# Altium schematic sheet Base Station Schematic.SchDoc: Base Station Schematic
size A4; Organization: Altium Limited; Address1: L3, 12a Rodborough Rd; Address2: Frenchs Forest; Address3: NSW; Address4: Australia 2086; DocumentNumber: 1; Revision: V1.0; SheetNumber: 1; SheetTotal: 1
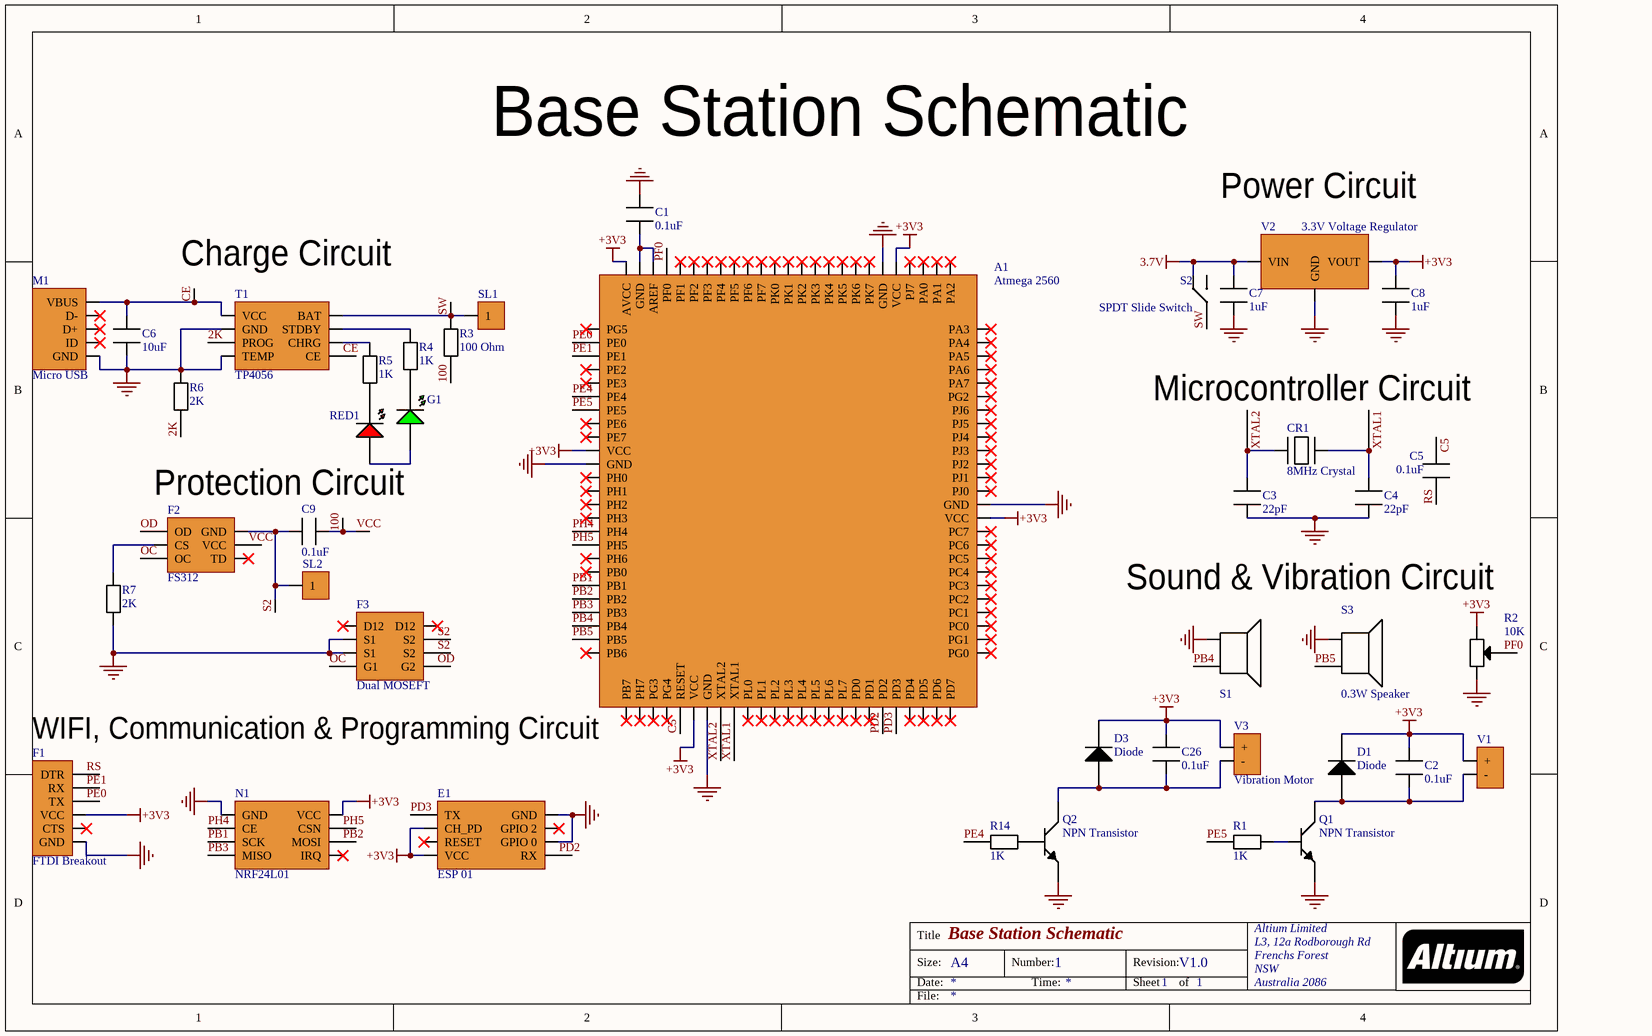
[diagram p0: Base Station Schematic.SchDoc]

## Parts
A1  Atmega 2560  [Atmega 2560]
C1  0.1uF  [0.1uF Capacitor]
C2  0.1uF  [0.1uF Capacitor]
C3  22pF  [22pF Capacitor]
C4  22pF  [22pF Capacitor]
C5  0.1uF  [0.1uF Capacitor]
C6  10uF  [10uF Capactior]
C7  1uF  [1uF Capacitor]
C8  1uF  [1uF Capacitor]
C9  0.1uF  [0.1uF Capacitor]
C26  0.1uF  [0.1uF Capacitor]
CR1  8MHz Crystal  [8MHz Crystal]
D1  Diode  [Diode]
D3  Diode  [Diode]
E1  ESP 01  [ESP 01]
F1  FTDI Breakout  [FTDI]
F2  FS312  [FS312]
F3  Dual MOSEFT  [FS8205]
G1  Green LED  [Green LED]  (value not drawn)
M1  Micro USB  [Micro USB]
N1  NRF24L01  [NRF24L01]
Q1  NPN Transistor  [NPN Transistor]
Q2  NPN Transistor  [NPN Transistor]
R1  1K  [1K Resistor]
R2  10K  [10K Potentiometer]
R3  100 Ohm  [100 Ohm Resistor]
R4  1K  [1K Resistor]
R5  1K  [1K Resistor]
R6  2K  [2K Resistor]
R7  2K  [2K Resistor]
R14  1K  [1K Resistor]
RED1  Red LED  [Red LED]  (value not drawn)
S1  0.3W Speaker  [0.3W Speaker]  (value not drawn)
S2  SPDT Slide Switch  [Slide Switch]
S3  0.3W Speaker  [0.3W Speaker]
SL1  Solder Pads  [Solder Pads]  (value not drawn)
SL2  Solder Pads  [Solder Pads]  (value not drawn)
T1  TP4056  [TP4056]
V1  Vibration Motor  [Vibration Motor]  (value not drawn)
V2  3.3V Voltage Regulator  [Voltage Regulator]
V3  Vibration Motor  [Vibration Motor]

## Nets
3.7V: C7.2 S2.3 V2.3(VIN)
+3V3: A1.10(VCC) A1.31(VCC) A1.61(VCC) A1.80(VCC) A1.100(AVCC) C2.1 C8.2 C26.2 D1.1 D3.1 E1.2(CH_PD) E1.4(VCC) F1.4(VCC) N1.5(VCC) R2.1 V1.2(+) V2.2(VOUT) V3.2(+)
GND: A1.11(GND) A1.32(GND) A1.62(GND) A1.81(GND) C1.1 C3.1 C4.1 C6.1 C7.1 C8.1 E1.5(GND) E1.7(GPIO_0) F1.6(GND) F3.2(S1) F3.3(S1) M1.5(GND) N1.1(GND) Q1.2 Q2.2 R2.3 R6.2 R7.1 S1.1 S3.1 T1.1(TEMP) T1.3(GND) V2.1(GND)
2K: R6.1 T1.2(PROG)
100: C9.1 F2.5(VCC) R3.2  [also labelled VCC]
C5: A1.30(RESET) C5.2
CE: C6.2 M1.1(VBUS) T1.4(VCC) T1.8(CE)
OC: F2.3(OC) F3.4(G1)
OD: F2.1(OD) F3.5(G2)
PB1: A1.20(PB1) N1.3(SCK)
PB2: A1.21(PB2) N1.7(MOSI)
PB3: A1.22(PB3) N1.4(MISO)
PB4: A1.23(PB4) S1.2
PB5: A1.24(PB5) S3.2
PD2: A1.45(PD2) E1.8(RX)
PD3: A1.46(PD3) E1.1(TX)
PE0: A1.2(PE0) F1.3(TX)
PE1: A1.3(PE1) F1.2(RX)
PE4: A1.6(PE4) R14.1
PE5: A1.7(PE5) R1.1
PF0: A1.97(PF0) R2.2
PH4: A1.16(PH4) N1.2(CE)
PH5: A1.17(PH5) N1.6(CSN)
RS: C5.1 F1.1(DTR)
S2: C9.2 F2.6(GND) F3.6(S2) F3.7(S2) SL2.1
SW: R3.1 S2.2 SL1.1 T1.5(BAT)
XTAL1: A1.34(XTAL1) C4.2 CR1.2
XTAL2: A1.33(XTAL2) C3.2 CR1.1
NetA1_98: A1.98(AREF) A1.99(GND) C1.2
NetC2_2: C2.2 D1.2 Q1.3 V1.1(-)
NetC26_1: C26.1 D3.2 Q2.3 V3.1(-)
NetF2_2: F2.2(CS) R7.2
NetG1_1: G1.1 R4.1
NetG1_2: G1.2 RED1.2
NetQ1_1: Q1.1 R1.2
NetQ2_1: Q2.1 R14.2
NetR4_2: R4.2 T1.6(STDBY)
NetR5_1: R5.1 RED1.1
NetR5_2: R5.2 T1.7(CHRG)

Not connected (* = marked no-connect by the designer): A1 1(PG5)* 4(PE2)* 5(PE3)* 8(PE6)* 9(PE7)* 12(PH0)* 13(PH1)* 14(PH2)* 15(PH3)* 18(PH6)* 19(PB0)* 25(PB6)* 26(PB7)* 27(PH7)* 28(PG3)* 29(PG4)* 35(PL0)* 36(PL1)* 37(PL2)* 38(PL3)* 39(PL4)* 40(PL5)* 41(PL6)* 42(PL7)* 43(PD0)* 44(PD1)* 47(PD4)* 48(PD5)* 49(PD6)* 50(PD7)* 51(PG0)* 52(PG1)* 53(PC0)* 54(PC1)* 55(PC2)* 56(PC3)* 57(PC4)* 58(PC5)* 59(PC6)* 60(PC7)* 63(PJ0)* 64(PJ1)* 65(PJ2)* 66(PJ3)* 67(PJ4)* 68(PJ5)* 69(PJ6)* 70(PG2)* 71(PA7)* 72(PA6)* 73(PA5)* 74(PA4)* 75(PA3)* 76(PA2)* 77(PA1)* 78(PA0)* 79(PJ7)* 82(PK7)* 83(PK6)* 84(PK5)* 85(PK4)* 86(PK3)* 87(PK2)* 88(PK1)* 89(PK0)* 90(PF7)* 91(PF6)* 92(PF5)* 93(PF4)* 94(PF3)* 95(PF2)* 96(PF1)*; E1 3(RESET)* 6(GPIO_2)*; F1 5(CTS)*; F2 4(TD)*; F3 1(D12)* 8(D12)*; M1 2(D-)* 3(D+)* 4(ID)*; N1 8(IRQ)*; S2 1

## Notes on the sheet
- Power Circuit
- Charge Circuit
- Microcontroller Circuit
- (near RED1) Protection Circuit
- Sound & Vibration Circuit
- (near A1) WIFI, Communication & Programming Circuit
- Title
- Size:
- Date:
- A4
- Number:
- Time:
- Revision:
- Sheet
- of
- File:

## Library data of the parts
A1 = ATMEGA2560V-8AU: MICROCHIP - ATMEGA2560V-8AU - 8 Bit MCU, AVR ATmega Family ATmega256X Series Microcontrollers, 8 MHz, 256 KB, 8 KB, 100 Pins; Manufacturer: Microchip / Atmel; Data Bus Width: 8b; Min Supply Voltage: 1.8V; Max Supply Voltage: 5.5V; Interface: I2C,SPI,UART,USART,EBI/EMI,2-Wire; Number of Inputs: 86; Number of PWM Channels: 16; RAM Size: 8KB; Number of Timers/Counters: 6; Frequency: 8MHz; Density: 256KB; Number of UART Channels: 4; Oscillator Type: Internal; Memory Type: FLASH; Number of Bits: 8; Number of SPI Channels: 1; Watchdog Timer: Yes; Access Time: 8us; Peripherals: Brown-out Detect/Reset,POR,PWM,WDT; Supplier 1: Digi-Key; Manufacturer Part Number: ATMEGA2560V-8AU; RoHS: Yes; Category: Microcontrollers; Stock 1: 509; Pricing 1: 1=11.85000, 25=10.86000, 100=9.84000 (USD); Mount: Surface Mount; Case/Package: A; Number of Pins: 100; Contact Plating: Tin,Matte; Min Operating Temperature: -40°C; Max Operating Temperature: 85°C; Package Quantity: 90; Core Architecture: AVR; Packaging: Tray; Number of Outputs: 86; Number of I/Os: 86; Number of ADC Channels: 16; Number of Programmable I/O: 86; Max Frequency: 8MHz; Number of I2C Channels: 1; Address Bus Width: 8b; Memory Size: 256KB; Length: 14.1mm; Width: 14.1mm; Height: 1.05mm; Radiation Hardening: No; REACH SVHC: No SVHC; Lead Free: Lead Free; ComponentLink1URL: https://datasheet.ciiva.com/1497/2549s-1497984.pdf?src-supplier=Digi-Key; ComponentLink1Description: https://datasheet.ciiva.com/1497/2549s-1497984.pdf?src-supplier=Digi-Key; ComponentLink2URL: https://datasheet.ciiva.com/22651/82608-22651121.pdf?src-supplier=Farnell; ComponentLink2Description: https://datasheet.ciiva.com/22651/82608-22651121.pdf?src-supplier=Farnell; ComponentLink3URL: https://datasheet.ciiva.com/15122/getdatasheetpartid-144096-15122668.pdf?src-supplier=Verical; ComponentLink3Description: https://datasheet.ciiva.com/15122/getdatasheetpartid-144096-15122668.pdf?src-supplier=Verical; ComponentLink4URL: https://datasheet.ciiva.com/26815/atmega2560v-8au-26815443.pdf?src-supplier=IIIC; ComponentLink4Description: https://datasheet.ciiva.com/26815/atmega2560v-8au-26815443.pdf?src-supplier=IIIC; ComponentLink5URL: https://datasheet.ciiva.com/29329/154791-da-01-en-atmega2560v-8au-tqfp-100-29329598.pdf?src-supplier=Conrad; ComponentLink5Description: https://datasheet.ciiva.com/29329/154791-da-01-en-atmega2560v-8au-tqfp-100-29329598.pdf?src-supplier=Conrad; ComponentLink6URL: https://datasheet.ciiva.com/1157/82608-1157522.pdf?src-supplier=Element14; ComponentLink6Description: https://datasheet.ciiva.com/1157/82608-1157522.pdf?src-supplier=Element14; ComponentLink7URL: https://datasheet.ciiva.com/16935/70123980-16935865.pdf?src-supplier=Allied+Electronics; ComponentLink7Description: https://datasheet.ciiva.com/16935/70123980-16935865.pdf?src-supplier=Allied+Electronics; Supplier Part Number 1: ATMEGA2560V-8AU-ND
C1 C2 C5 C9 C26 = 06033C104KAT4A: CAP CER 0.1UF 25V X7R 0603; Manufacturer: Kyocera AVX; Capacitance: 100nF; Tolerance: 10%; Supplier 1: Digi-Key; Manufacturer Part Number: 06033C104KAT4A; RoHS: Yes; Category: Ceramic Capacitors; Stock 1: 6112957; Pricing 1: 1=0.10000, 10=0.04200, 50=0.02320, 100=0.01890, 500=0.01348, 1000=0.01059, 2500=0.00962, 5000=0.00886 (USD); Mount: Surface Mount; Case/Package: 0603; Number of Pins: 2; Case Code (Metric): 1608; Case Code (Imperial): 0603; Min Operating Temperature: -55°C; Max Operating Temperature: 125°C; Packaging: Tape and Reel; Voltage Rating (DC): 25V; Dielectric: X7R; Package Quantity: 1; Voltage Rating: 25V; Termination: SMD/SMT; Length: 1.6mm; Width: 0.032inch; Height: 0.9mm; Thickness: 0.035inch; Depth: 0.81mm; REACH SVHC: No SVHC; Lead Free: Lead Free; ComponentLink1URL: https://datasheet.ciiva.com/22619/1679506-22619862.pdf?src-supplier=Element14; ComponentLink1Description: https://datasheet.ciiva.com/22619/1679506-22619862.pdf?src-supplier=Element14; ComponentLink2URL: https://datasheet.ciiva.com/28613/1679506-28613035.pdf?src-supplier=Element14; ComponentLink2Description: https://datasheet.ciiva.com/28613/1679506-28613035.pdf?src-supplier=Element14; ComponentLink3URL: https://datasheet.ciiva.com/6277/cx7r-6277758.pdf?src-supplier=Digi-Key; ComponentLink3Description: https://datasheet.ciiva.com/6277/cx7r-6277758.pdf?src-supplier=Digi-Key; ComponentLink4URL: https://datasheet.ciiva.com/6277/cx7r-6277759.pdf?src-supplier=Digi-Key; ComponentLink4Description: https://datasheet.ciiva.com/6277/cx7r-6277759.pdf?src-supplier=Digi-Key; Supplier Part Number 1: 478-7018-1-ND
C3 C4 = 06035A220JAT2A: Cap Ceramic 22pF 50V C0G 5% SMD 0603 125C Paper T/R; Manufacturer: Kyocera AVX; Insulation Resistance: 100GR; Temperature Coefficient: 30ppm/°C; Supplier 1: Digi-Key; Manufacturer Part Number: 06035A220JAT2A; RoHS: Yes; Category: Ceramic Capacitors; Stock 1: 678111; Pricing 1: 1=0.10000, 10=0.05600, 50=0.03040, 100=0.02480, 500=0.01772, 1000=0.01392 (USD); Mount: Surface Mount,PCB; Case/Package: 0603; Number of Pins: 2; Case Code (Imperial): 0603; Case Code (Metric): 1608; Contact Plating: Tin,Matte; Dielectric Material: Ceramic; Min Operating Temperature: -55°C; Max Operating Temperature: 125°C; Tolerance: 5%; Capacitance: 22pF; Voltage Rating (DC): 50V; Packaging: Tape and Reel; Dielectric: C0G; Voltage: 50V; Voltage Rating: 50V; Package Quantity: 1; Termination: SMD/SMT; Length: 1.6mm; Width: 0.81mm; Height: 0.63mm; Thickness: 0.035inch; Depth: 0.81mm; Radiation Hardening: No; REACH SVHC: No SVHC; Lead Free: Lead Free; ComponentLink1URL: https://datasheet.ciiva.com/11788/0900766b802d4697-11788031.pdf?src-supplier=RSComponents; ComponentLink1Description: https://datasheet.ciiva.com/11788/0900766b802d4697-11788031.pdf?src-supplier=RSComponents; ComponentLink2URL: https://datasheet.ciiva.com/16351/ccog-16351125.pdf?src-supplier=Future+Electronics; ComponentLink2Description: https://datasheet.ciiva.com/16351/ccog-16351125.pdf?src-supplier=Future+Electronics; ComponentLink3URL: https://datasheet.ciiva.com/1124/759117-1124728.pdf?src-supplier=Element14; ComponentLink3Description: https://datasheet.ciiva.com/1124/759117-1124728.pdf?src-supplier=Element14; ComponentLink4URL: https://datasheet.ciiva.com/7855/759117-7855064.pdf?src-supplier=Element14; ComponentLink4Description: https://datasheet.ciiva.com/7855/759117-7855064.pdf?src-supplier=Element14; ComponentLink5URL: https://datasheet.ciiva.com/150/ccog-150366.pdf?src-supplier=Digi-Key; ComponentLink5Description: https://datasheet.ciiva.com/150/ccog-150366.pdf?src-supplier=Digi-Key; ComponentLink6URL: https://datasheet.ciiva.com/150/ccog-150367.pdf?src-supplier=Digi-Key; ComponentLink6Description: https://datasheet.ciiva.com/150/ccog-150367.pdf?src-supplier=Digi-Key; Supplier Part Number 1: 478-1167-1-ND
C6 = 06036D106MAT2A: AVX - 06036D106MAT2A - SMD Multilayer Ceramic Capacitor, 10 µF, 6.3 V, 0603 [1608 Metric], ± 20%, X5R, AVX 0603 MLCC; Manufacturer: Kyocera AVX; Voltage Rating: 6.3V; Supplier 1: Digi-Key; Manufacturer Part Number: 06036D106MAT2A; RoHS: Yes; Category: Ceramic Capacitors; Stock 1: 2195219; Pricing 1: 1=0.24000, 10=0.16500, 50=0.09900, 100=0.08360, 500=0.05720, 1000=0.05060 (USD); Mount: Surface Mount,PCB; Case/Package: 0603; Number of Pins: 2; Case Code (Metric): 1608; Case Code (Imperial): 0603; Contact Plating: Tin,Matte; Dielectric Material: Ceramic; Min Operating Temperature: -55°C; Max Operating Temperature: 85°C; Capacitance: 10uF; Tolerance: 20%; Packaging: Tape and Reel; Package Quantity: 1; Voltage Rating (DC): 6.3V; Dielectric: X5R; Termination: SMD/SMT; Voltage: 6.3V; Length: 1.6mm; Width: 0.032inch; Height: 0.9mm; Thickness: 0.035inch; Depth: 0.81mm; Radiation Hardening: No; REACH SVHC: No SVHC; Lead Free: Lead Free; ComponentLink1URL: https://datasheet.ciiva.com/153/cx5r-153301.pdf?src-supplier=Digi-Key; ComponentLink1Description: https://datasheet.ciiva.com/153/cx5r-153301.pdf?src-supplier=Digi-Key; ComponentLink2URL: https://datasheet.ciiva.com/1458/1796776-1458117.pdf?src-supplier=Element14; ComponentLink2Description: https://datasheet.ciiva.com/1458/1796776-1458117.pdf?src-supplier=Element14; ComponentLink3URL: https://datasheet.ciiva.com/153/cx5r-153302.pdf?src-supplier=Digi-Key; ComponentLink3Description: https://datasheet.ciiva.com/153/cx5r-153302.pdf?src-supplier=Digi-Key; ComponentLink4URL: https://datasheet.ciiva.com/153/cx5r-153303.pdf?src-supplier=Digi-Key; ComponentLink4Description: https://datasheet.ciiva.com/153/cx5r-153303.pdf?src-supplier=Digi-Key; ComponentLink5URL: https://datasheet.ciiva.com/5422/cx5r-33896-5422935.pdf?src-supplier=Mouser; ComponentLink5Description: https://datasheet.ciiva.com/5422/cx5r-33896-5422935.pdf?src-supplier=Mouser; ComponentLink6URL: https://datasheet.ciiva.com/16538/cx5r-16538025.pdf?src-supplier=Avnet+Asia; ComponentLink6Description: https://datasheet.ciiva.com/16538/cx5r-16538025.pdf?src-supplier=Avnet+Asia; ComponentLink7URL: https://datasheet.ciiva.com/2987/cx5r-2987866.pdf?src-supplier=Avnet; ComponentLink7Description: https://datasheet.ciiva.com/2987/cx5r-2987866.pdf?src-supplier=Avnet; ComponentLink8URL: https://datasheet.ciiva.com/14591/70001028-14591754.pdf?src-supplier=Allied+Electronics; ComponentLink8Description: https://datasheet.ciiva.com/14591/70001028-14591754.pdf?src-supplier=Allied+Electronics; ComponentLink9URL: https://datasheet.ciiva.com/2987/cx5r-2987867.pdf?src-supplier=Avnet; ComponentLink9Description: https://datasheet.ciiva.com/2987/cx5r-2987867.pdf?src-supplier=Avnet; ComponentLink10URL: https://datasheet.ciiva.com/16201/cx5r-16201627.pdf?src-supplier=Future+Electronics; ComponentLink10Description: https://datasheet.ciiva.com/16201/cx5r-16201627.pdf?src-supplier=Future+Electronics; Supplier Part Number 1: 478-5318-1-ND
C7 C8 = 0603ZD105KAT2A: Cap Ceramic 1uF 10V X5R 10% Pad SMD 0603 85C T/R; Manufacturer: Kyocera AVX; Dissipation Factor: 5%; Insulation Resistance: 100GR; Supplier 1: Digi-Key; Manufacturer Part Number: 0603ZD105KAT2A; RoHS: Yes; Category: Ceramic Capacitors; Stock 1: 367092; Pricing 1: 1=0.19000, 10=0.13400, 50=0.07620, 100=0.06320, 500=0.04428, 1000=0.03666 (USD); Mount: Surface Mount,PCB; Case/Package: 0603; Number of Pins: 2; Case Code (Imperial): 0603; Case Code (Metric): 1608; Contact Plating: Tin,Matte; Min Operating Temperature: -55°C; Max Operating Temperature: 85°C; Capacitance: 1uF; Package Quantity: 4000; Voltage Rating: 10V; Voltage Rating (DC): 10V; Tolerance: 10%; Packaging: Tape and Reel; Dielectric: X5R; Termination: SMD/SMT; Voltage: 10V; Length: 1.6mm; Width: 0.81mm; Height: 0.9mm; Thickness: 0.035inch; Depth: 0.81mm; Radiation Hardening: No; REACH SVHC: No SVHC; Lead Free: Lead Free; ComponentLink1URL: https://datasheet.ciiva.com/11787/0900766b80a45521-11787469.pdf?src-supplier=RSComponents; ComponentLink1Description: https://datasheet.ciiva.com/11787/0900766b80a45521-11787469.pdf?src-supplier=RSComponents; ComponentLink2URL: https://datasheet.ciiva.com/2987/cx5r-2987907.pdf?src-supplier=Avnet; ComponentLink2Description: https://datasheet.ciiva.com/2987/cx5r-2987907.pdf?src-supplier=Avnet; ComponentLink3URL: https://datasheet.ciiva.com/150/cx5r-150308.pdf?src-supplier=Digi-Key; ComponentLink3Description: https://datasheet.ciiva.com/150/cx5r-150308.pdf?src-supplier=Digi-Key; ComponentLink4URL: https://datasheet.ciiva.com/150/cx5r-150309.pdf?src-supplier=Digi-Key; ComponentLink4Description: https://datasheet.ciiva.com/150/cx5r-150309.pdf?src-supplier=Digi-Key; ComponentLink5URL: https://datasheet.ciiva.com/16538/cx5r-16538069.pdf?src-supplier=Avnet+Asia; ComponentLink5Description: https://datasheet.ciiva.com/16538/cx5r-16538069.pdf?src-supplier=Avnet+Asia; ComponentLink6URL: https://datasheet.ciiva.com/150/cx5r-150310.pdf?src-supplier=Digi-Key; ComponentLink6Description: https://datasheet.ciiva.com/150/cx5r-150310.pdf?src-supplier=Digi-Key; ComponentLink7URL: https://datasheet.ciiva.com/7855/1666675-7855113.pdf?src-supplier=Element14; ComponentLink7Description: https://datasheet.ciiva.com/7855/1666675-7855113.pdf?src-supplier=Element14; ComponentLink8URL: https://datasheet.ciiva.com/6128/84508-6128747.pdf?src-supplier=Farnell; ComponentLink8Description: https://datasheet.ciiva.com/6128/84508-6128747.pdf?src-supplier=Farnell; ComponentLink9URL: https://datasheet.ciiva.com/11462/cx5r-11462907.pdf?src-supplier=Avnet; ComponentLink9Description: https://datasheet.ciiva.com/11462/cx5r-11462907.pdf?src-supplier=Avnet; ComponentLink10URL: https://datasheet.ciiva.com/14604/70001028-14604907.pdf?src-supplier=Allied+Electronics; ComponentLink10Description: https://datasheet.ciiva.com/14604/70001028-14604907.pdf?src-supplier=Allied+Electronics; ComponentLink11URL: https://datasheet.ciiva.com/16200/cx5r-16200364.pdf?src-supplier=Future+Electronics; ComponentLink11Description: https://datasheet.ciiva.com/16200/cx5r-16200364.pdf?src-supplier=Future+Electronics; ComponentLink12URL: https://datasheet.ciiva.com/1458/1666675-1458205.pdf?src-supplier=Element14; ComponentLink12Description: https://datasheet.ciiva.com/1458/1666675-1458205.pdf?src-supplier=Element14; ComponentLink13URL: https://datasheet.ciiva.com/1458/1666675-1458206.pdf?src-supplier=Element14; ComponentLink13Description: https://datasheet.ciiva.com/1458/1666675-1458206.pdf?src-supplier=Element14; ComponentLink14URL: https://datasheet.ciiva.com/1458/84508-1458207.pdf?src-supplier=Element14; ComponentLink14Description: https://datasheet.ciiva.com/1458/84508-1458207.pdf?src-supplier=Element14; Supplier Part Number 1: 478-1251-1-ND
CR1 = FC4SDCBMF8.0-T1: Crystal 8MHz ±30ppm (Tol) ±50ppm (Stability) 20pF FUND 80Ohm 2-Pin HC-49/SDLF SMD T/R; Manufacturer: Fox Electronics; Supplier 1: Digi-Key; Manufacturer Part Number: FC4SDCBMF8.0-T1; RoHS: No; Stock 1: 17704; Pricing 1: 1=0.29000, 10=0.24200, 50=0.21740, 100=0.19320, 500=0.18354 (USD); ComponentLink1URL: http://www.foxonline.com/pdfs/C4SD.pdf?src-supplier=Digi-Key; ComponentLink1Description: http://www.foxonline.com/pdfs/C4SD.pdf?src-supplier=Digi-Key; Supplier Part Number 1: 631-1010-1-ND
D1 D3 = CD0603-B0240R: BOURNS - CD0603-B0240R - Kleinsignal-Schottky-Diode, Einfach, 40 V, 200 mA, 500 mV, 2 A, 125 °C; Max Reverse Voltage (DC): 40V; Average Rectified Current: 200mA; Supplier 1: Digi-Key; Manufacturer: Bourns; Manufacturer Part Number: CD0603-B0240R; RoHS: Yes; Category: Rectifier Diodes; Stock 1: 32978; Pricing 1: 1=0.38000, 10=0.28000, 100=0.13300, 500=0.10850, 1000=0.08050 (USD); Mount: Surface Mount; Case/Package: 0603; Case Code (Imperial): 0603; Case Code (Metric): 1608; Packaging: Tape and Reel; ComponentLink1URL: http://www.farnell.com/datasheets/2372434.pdf?src-supplier=Farnell; ComponentLink1Description: http://www.farnell.com/datasheets/2372434.pdf?src-supplier=Farnell; ComponentLink2URL: http://www.farnell.com/datasheets/2372434.pdf?src-supplier=Newark; ComponentLink2Description: http://www.farnell.com/datasheets/2372434.pdf?src-supplier=Newark; ComponentLink3URL: https://www.bourns.com/docs/product-datasheets/cd0603-b.pdf?src-supplier=Digi-Key; ComponentLink3Description: https://www.bourns.com/docs/product-datasheets/cd0603-b.pdf?src-supplier=Digi-Key; ComponentLink4URL: http://www.farnell.com/datasheets/2372434.pdf?src-supplier=Element14; ComponentLink4Description: http://www.farnell.com/datasheets/2372434.pdf?src-supplier=Element14; Supplier Part Number 1: CD0603-B0240RCT-ND
E1 = ESP 01: ESP8266 ESP-01 Serial WIFI Wireless Transceiver Module Send Receive LWIP AP+STA
F1 = FTDI: FTDI USB to TTL serial converter module
F2 = FS312: ONE CELL LI-ION/LI-PO BATTERY PROTECTION IC
F3 = FS8205: FS8205A DUAL N-CHANNEL POWER MOSFET
G1 = 151051VS04000: WURTH ELEKTRONIK - 151051VS04000 - LED, Green, Through Hole, T-1 3/4 (5mm), 30 mA, 2.1 V, 572 nm; Manufacturer: Wurth Electronics; Wavelength: 572nm; Viewing Angle: 40°; Lens Style: Diffused,Circular,Round; Luminous Intensity: 140mcd; Forward Voltage: 2.1V; Test Current: 20mA; Forward Current: 30mA; Supplier 1: Digi-Key; Manufacturer Part Number: 151051VS04000; RoHS: Yes; Category: LEDs; Stock 1: 4109; Pricing 1: 1=0.25000, 50=0.23000, 100=0.19800, 500=0.17200 (USD); Mount: Through Hole; Case/Package: Radial; Color: Green; Min Operating Temperature: -40°C; Max Operating Temperature: 85°C; Package Quantity: 1; Dominant Wavelength: 572nm; Height: 8.9mm; Lens Size: 5mm; REACH SVHC: Unknown; ComponentLink1URL: https://datasheet.ciiva.com/23843/151051vs04000-23843282.pdf?src-supplier=Newark; ComponentLink1Description: https://datasheet.ciiva.com/23843/151051vs04000-23843282.pdf?src-supplier=Newark; ComponentLink2URL: https://datasheet.ciiva.com/29363/759491-da-01-en-tht-led-5mm-b-gruen-151051vs04000-29363828.pdf?src-supplier=Conrad; ComponentLink2Description: https://datasheet.ciiva.com/29363/759491-da-01-en-tht-led-5mm-b-gruen-151051vs04000-29363828.pdf?src-supplier=Conrad; ComponentLink3URL: https://datasheet.ciiva.com/29562/151051vs04000-29562903.pdf?src-supplier=Digi-Key; ComponentLink3Description: https://datasheet.ciiva.com/29562/151051vs04000-29562903.pdf?src-supplier=Digi-Key; ComponentLink4URL: https://datasheet.ciiva.com/48429/151051vs04000-eng-tds-48429978.pdf?src-supplier=Distrelec; ComponentLink4Description: https://datasheet.ciiva.com/48429/151051vs04000-eng-tds-48429978.pdf?src-supplier=Distrelec; Supplier Part Number 1: 732-5017-ND
M1 = 629105136821: WURTH ELEKTRONIK - 629105136821 - Connecteur USB, Micro USB Type B, USB 2.0, Embase, 5 Voies, Montage en surface, Coudée; Manufacturer: Wurth Electronics; Plating: Nickel; Current Rating: 1.8A; Gender: Receptacle; Voltage Rating: 30V; Number of Contacts: 5; Insulation Resistance: 1GR; Number of Ports: 1; USB Standard: USB 2.0; Supplier 1: Digi-Key; Manufacturer Part Number: 629105136821; RoHS: Yes; Category: Connectors; Stock 1: 10633; Pricing 1: 1=1.21000, 10=1.19200, 50=1.10700, 100=1.02100, 500=0.93600 (USD); Mount: Surface Mount,Horizontal; Contact Plating: Gold; Contact Material: Copper Alloy; Color: Black; Min Operating Temperature: -40°C; Max Operating Temperature: 105°C; Package Quantity: 1400; Packaging: Tape and Reel; Connector Type: USB; Number of Positions: 5; Termination: Solder; Orientation: Right Angle; Length: 5.9mm; Lead Free: Lead Free; REACH SVHC: Unknown; Flammability Rating: UL94 V-0; ComponentLink1URL: https://datasheet.ciiva.com/851/629105136821-851196.pdf?src-supplier=Digi-Key; ComponentLink1Description: https://datasheet.ciiva.com/851/629105136821-851196.pdf?src-supplier=Digi-Key; ComponentLink2URL: https://datasheet.ciiva.com/12494/629105136821-221118-12494781.pdf?src-supplier=Mouser; ComponentLink2Description: https://datasheet.ciiva.com/12494/629105136821-221118-12494781.pdf?src-supplier=Mouser; ComponentLink3URL: https://datasheet.ciiva.com/851/629105136821-851197.pdf?src-supplier=Digi-Key; ComponentLink3Description: https://datasheet.ciiva.com/851/629105136821-851197.pdf?src-supplier=Digi-Key; ComponentLink4URL: https://datasheet.ciiva.com/851/629105136821-851198.pdf?src-supplier=Digi-Key; ComponentLink4Description: https://datasheet.ciiva.com/851/629105136821-851198.pdf?src-supplier=Digi-Key; Supplier Part Number 1: 732-3155-1-ND
N1 = NRF24L01: 3.3V NRF24L01 WIRELESS RF MODULE
Q1 Q2 = MMBT3904,215: MMBT3904 Series 40 V 200 mA 250 mW NPN Switching Transistor - SOT-23-3; Manufacturer: Nexperia; Supplier 1: Digi-Key; Manufacturer Part Number: MMBT3904,215; RoHS: No; Category: BJTs; Stock 1: 161449; Pricing 1: 1=0.10000, 10=0.08800, 25=0.08360, 100=0.03690, 500=0.02894, 1000=0.02010 (USD); ComponentLink1URL: http://www.farnell.com/datasheets/2328888.pdf?src-supplier=Farnell; ComponentLink1Description: http://www.farnell.com/datasheets/2328888.pdf?src-supplier=Farnell; ComponentLink2URL: https://assets.nexperia.com/documents/data-sheet/MMBT3904.pdf?src-supplier=Digi-Key; ComponentLink2Description: https://assets.nexperia.com/documents/data-sheet/MMBT3904.pdf?src-supplier=Digi-Key; ComponentLink3URL: http://www.farnell.com/datasheets/2328888.pdf?src-supplier=Newark; ComponentLink3Description: http://www.farnell.com/datasheets/2328888.pdf?src-supplier=Newark; Supplier Part Number 1: 1727-4044-1-ND
R1 R4 R5 R14 = RNCF0603TKY1K00: RES 1K OHM 0.01% 1/10W 0603; Manufacturer: Stackpole Electronics; Max Power Dissipation: 100mW; Temperature Coefficient: 5ppm/°C; Resistance: 1kR; Supplier 1: Digi-Key; Manufacturer Part Number: RNCF0603TKY1K00; RoHS: Yes; Category: Chip SMD Resistors; Stock 1: 3970; Pricing 1: 1=1.86000, 10=1.65000, 100=1.26000 (USD); Mount: Surface Mount; Case/Package: 0603; Case Code (Imperial): 0603; Case Code (Metric): 1608; Min Operating Temperature: -55°C; Max Operating Temperature: 155°C; Features: Moisture Resistant; Resistor Type: Thin Film; Number of Terminations: 2; Tolerance: 0.01%; Packaging: Tape and Reel; Length: 0.063inch; Width: 0.031inch; Height: 0.022inch; Lead Free: Lead Free; ComponentLink1URL: https://www.seielect.com/catalog/SEI-Packaging.pdf?src-supplier=Digi-Key; ComponentLink1Description: https://www.seielect.com/catalog/SEI-Packaging.pdf?src-supplier=Digi-Key; Supplier Part Number 1: RNCF0603TKY1K00CT-ND
R2 = 91A1A-B28-B15L: BOURNS   91A1A-B28-B15L   Rotary Potentiometer, Conductive Plastic, 91 Series, 10 kohm, Linear, 1 Turns, 1 W, Through Hole; Voltage Rating (DC): 500V; Voltage Rating (AC): 350V; Max Power Dissipation: 1W; Linearity: 5%; Number of Turns: 1; Temperature Coefficient: 1000ppm/°C; Resistance: 10kR; Tolerance: 20%; Actuator Length: 0.875inch; Actuator Diameter: 0.25inch; Hole Diameter: 9.525mm; Ratings: IP40; Supplier 1: Digi-Key; Manufacturer: Bourns; Manufacturer Part Number: 91A1A-B28-B15L; RoHS: Yes; Category: Variable Resistors and Potentiometers; Stock 1: 8257; Pricing 1: 1=6.30000, 10=5.77500, 25=5.14520, 50=4.83000, 100=4.41000, 250=3.57000, 500=3.36000, 1000=3.15000, 5000=2.83500 (USD); Mount: Panel,Through Hole; Contact Plating: Tin; Weight: 12.7g; Min Operating Temperature: -40°C; Max Operating Temperature: 125°C; Resistor Type: Conductive Plastic; Taper: Linear; Termination: Pin; Number of Gangs: 1; Power Rating: 1W; Package Quantity: 5; Packaging: Bulk; Type: Potentiometer; Length: 34.93mm; Width: 15.88mm; Height: 17.47mm; Depth: 15.88mm; Radiation Hardening: No; Lead Free: Lead Free; REACH SVHC: No SVHC; Military Standard: Not; ComponentLink1URL: https://datasheet.ciiva.com/11831/0900766b806d6d25-11831307.pdf?src-supplier=RSComponents; ComponentLink1Description: https://datasheet.ciiva.com/11831/0900766b806d6d25-11831307.pdf?src-supplier=RSComponents; ComponentLink2URL: https://datasheet.ciiva.com/3890/42911771s9459740n1506-3890671.pdf?src-supplier=Arrow+Electronics; ComponentLink2Description: https://datasheet.ciiva.com/3890/42911771s9459740n1506-3890671.pdf?src-supplier=Arrow+Electronics; ComponentLink3URL: https://datasheet.ciiva.com/15156/getdatasheetpartid-30645-15156250.pdf?src-supplier=Verical; ComponentLink3Description: https://datasheet.ciiva.com/15156/getdatasheetpartid-30645-15156250.pdf?src-supplier=Verical; ComponentLink4URL: https://datasheet.ciiva.com/48425/91-95-series-eng-tds-48425214.pdf?src-supplier=Distrelec; ComponentLink4Description: https://datasheet.ciiva.com/48425/91-95-series-eng-tds-48425214.pdf?src-supplier=Distrelec; ComponentLink5URL: https://datasheet.ciiva.com/1476/1718056-1476215.pdf?src-supplier=Element14; ComponentLink5Description: https://datasheet.ciiva.com/1476/1718056-1476215.pdf?src-supplier=Element14; ComponentLink6URL: https://datasheet.ciiva.com/2152/91-95-2152606.pdf?src-supplier=Digi-Key; ComponentLink6Description: https://datasheet.ciiva.com/2152/91-95-2152606.pdf?src-supplier=Digi-Key; ComponentLink7URL: https://datasheet.ciiva.com/30119/90sers-30119247.pdf?src-supplier=Onlinecomponents.com; ComponentLink7Description: https://datasheet.ciiva.com/30119/90sers-30119247.pdf?src-supplier=Onlinecomponents.com; Supplier Part Number 1: 91A1A-B28-B15L-ND
R3 = RNCF0603TKY100R: RES SMD 100 OHM 0.01% 1/10W 0603; Manufacturer: Stackpole Electronics; Resistance: 100R; Max Power Dissipation: 100mW; Temperature Coefficient: 5ppm/°C; Supplier 1: Digi-Key; Manufacturer Part Number: RNCF0603TKY100R; RoHS: Yes; Category: Chip SMD Resistors; Stock 1: 4581; Pricing 1: 1=1.86000, 10=1.65000, 100=1.26000 (USD); Mount: Surface Mount; Case/Package: 0603; Case Code (Imperial): 0603; Case Code (Metric): 1608; Min Operating Temperature: -55°C; Max Operating Temperature: 155°C; Tolerance: 0.01%; Packaging: Tape and Reel; Resistor Type: Thin Film; Features: Moisture Resistant; Number of Terminations: 2; Length: 0.063inch; Width: 0.031inch; Height: 0.022inch; Depth: 0.8mm; Lead Free: Lead Free; Military Standard: Not; ComponentLink1URL: http://components.arrow.com/part/dataview/53543996S797665N1174?src-supplier=Arrow+Electronics; ComponentLink1Description: http://components.arrow.com/part/dataview/53543996S797665N1174?src-supplier=Arrow+Electronics; ComponentLink2URL: https://www.seielect.com/Catalog/SEI-RNCF.pdf?src-supplier=Digi-Key; ComponentLink2Description: https://www.seielect.com/Catalog/SEI-RNCF.pdf?src-supplier=Digi-Key; ComponentLink3URL: https://www.seielect.com/catalog/SEI-Packaging.pdf?src-supplier=Digi-Key; ComponentLink3Description: https://www.seielect.com/catalog/SEI-Packaging.pdf?src-supplier=Digi-Key; Supplier Part Number 1: RNCF0603TKY100RCT-ND
R6 R7 = RNCF0603TKY2K00: RES 2K OHM 0.01% 1/10W 0603; Manufacturer: Stackpole Electronics; Max Power Dissipation: 100mW; Temperature Coefficient: 5ppm/°C; Resistance: 2kR; Supplier 1: Digi-Key; Manufacturer Part Number: RNCF0603TKY2K00; RoHS: Yes; Category: Chip SMD Resistors; Stock 1: 25823; Pricing 1: 1=1.86000, 10=1.65000, 100=1.26000 (USD); Mount: Surface Mount; Case/Package: 0603; Case Code (Imperial): 0603; Case Code (Metric): 1608; Min Operating Temperature: -55°C; Max Operating Temperature: 155°C; Tolerance: 0.01%; Packaging: Tape and Reel; Resistor Type: Thin Film; Number of Terminations: 2; Features: Moisture Resistant; Length: 0.063inch; Width: 0.031inch; Height: 0.022inch; ComponentLink1URL: https://www.seielect.com/Catalog/SEI-RNCF.pdf?src-supplier=Digi-Key; ComponentLink1Description: https://www.seielect.com/Catalog/SEI-RNCF.pdf?src-supplier=Digi-Key; ComponentLink2URL: https://www.seielect.com/catalog/SEI-Packaging.pdf?src-supplier=Digi-Key; ComponentLink2Description: https://www.seielect.com/catalog/SEI-Packaging.pdf?src-supplier=Digi-Key; Supplier Part Number 1: RNCF0603TKY2K00CT-ND
RED1 = 151051RS11000: WURTH ELEKTRONIK - 151051RS11000 - LED, Red, Through Hole, T-1 3/4 (5mm), 30 mA, 2.1 V, 630 nm; Manufacturer: Wurth Electronics; Luminous Intensity: 30mcd; Forward Voltage: 2.1V; Viewing Angle: 60°; Lens Style: Diffused,Round,Circular; Wavelength: 630nm; Dominant Wavelength: 645nm; Test Current: 20mA; Forward Current: 30mA; Supplier 1: Digi-Key; Manufacturer Part Number: 151051RS11000; RoHS: Yes; Category: LEDs; Stock 1: 5782; Pricing 1: 1=0.16000, 50=0.14500, 100=0.12500, 500=0.10800 (USD); Mount: Through Hole; Case/Package: Radial; Color: Red; Min Operating Temperature: -40°C; Max Operating Temperature: 85°C; Package Quantity: 1; Height: 8.9mm; Lens Size: 5mm; REACH SVHC: Unknown; ComponentLink1URL: https://datasheet.ciiva.com/23843/151051rs11000-23843281.pdf?src-supplier=Newark; ComponentLink1Description: https://datasheet.ciiva.com/23843/151051rs11000-23843281.pdf?src-supplier=Newark; ComponentLink2URL: https://datasheet.ciiva.com/29335/759488-da-01-en-tht-led-5mm-rot-151051rs11000-29335455.pdf?src-supplier=Conrad; ComponentLink2Description: https://datasheet.ciiva.com/29335/759488-da-01-en-tht-led-5mm-rot-151051rs11000-29335455.pdf?src-supplier=Conrad; ComponentLink3URL: https://datasheet.ciiva.com/22657/1911506-22657034.pdf?src-supplier=Element14; ComponentLink3Description: https://datasheet.ciiva.com/22657/1911506-22657034.pdf?src-supplier=Element14; ComponentLink4URL: https://datasheet.ciiva.com/29562/151051rs11000-29562906.pdf?src-supplier=Digi-Key; ComponentLink4Description: https://datasheet.ciiva.com/29562/151051rs11000-29562906.pdf?src-supplier=Digi-Key; Supplier Part Number 1: 732-5016-ND
S1 S3 = SPEAKERMINIATURE2.5"8OHM: SPEAKER, 8OHM, 0.3W, 60MM; Manufacturer: CQR Components; Resistance: 8R; Supplier 1: Newark; Manufacturer Part Number: SPEAKERMINIATURE2.5"8OHM; RoHS: Yes; Category: Uncategorized; Impedance: 8R; ComponentLink1URL: https://datasheet.ciiva.com/1743/332038-1743864.pdf?src-supplier=Newark; ComponentLink1Description: https://datasheet.ciiva.com/1743/332038-1743864.pdf?src-supplier=Newark; ComponentLink2URL: https://datasheet.ciiva.com/1304/332038-1304605.pdf?src-supplier=Farnell; ComponentLink2Description: https://datasheet.ciiva.com/1304/332038-1304605.pdf?src-supplier=Farnell; ComponentLink3URL: https://datasheet.ciiva.com/1324/332038-1324222.pdf?src-supplier=Element14; ComponentLink3Description: https://datasheet.ciiva.com/1324/332038-1324222.pdf?src-supplier=Element14; Supplier Part Number 1: 07WX1236
S2 = JS102011SAQN: Slide Switch, JS Series, SPDT, Right Angle, SMD, 100 mA ;RoHS Compliant: Yes; Manufacturer: ITT C&K; Actuator Material: Nylon,Polyamide; Max Current Rating: 300mA; Voltage Rating (DC): 6V; Contact Resistance: 70mR; Electrical Life: 5000Cycles; Illumination Type: Non-Illuminated; Switch Travel: 2mm; Switch Function: On-On; Actuator Type: Standard; Supplier 1: Digi-Key; Manufacturer Part Number: JS102011SAQN; RoHS: Yes; Category: Slide Switches; Stock 1: 16762; Pricing 1: 1=0.63000, 10=0.61000, 25=0.58680, 100=0.50790, 250=0.46280, 500=0.42892 (USD); Mount: Surface Mount; Case/Package: 100; Contact Material: Copper Alloy,Copper,Silver; Contact Plating: Silver; Housing Material: Nylon; Min Operating Temperature: -40°C; Max Operating Temperature: 85°C; Packaging: Tape and Reel; Throw Configuration: SPDT; Package Quantity: 1; Max Voltage Rating (DC): 6V; Current Rating: 300mA; Contact Current Rating: 300mA; Termination: Gull Wing; Orientation: Right Angle; Length: 9mm; Actuator Length: 2mm; Radiation Hardening: No; REACH SVHC: No SVHC; Lead Free: Lead Free; ComponentLink1URL: https://datasheet.ciiva.com/1532/js-9dec14-1532400.pdf?src-supplier=Element14; ComponentLink1Description: https://datasheet.ciiva.com/1532/js-9dec14-1532400.pdf?src-supplier=Element14; ComponentLink2URL: https://datasheet.ciiva.com/16442/js102011saqn-16442775.pdf?src-supplier=Future+Electronics; ComponentLink2Description: https://datasheet.ciiva.com/16442/js102011saqn-16442775.pdf?src-supplier=Future+Electronics; ComponentLink3URL: https://datasheet.ciiva.com/5279/js-1nov12-221285-5279564.pdf?src-supplier=Mouser; ComponentLink3Description: https://datasheet.ciiva.com/5279/js-1nov12-221285-5279564.pdf?src-supplier=Mouser; ComponentLink4URL: https://datasheet.ciiva.com/18147/getdatasheetpartid-313004-18147207.pdf?src-supplier=Verical; ComponentLink4Description: https://datasheet.ciiva.com/18147/getdatasheetpartid-313004-18147207.pdf?src-supplier=Verical; ComponentLink5URL: https://datasheet.ciiva.com/2889/js-9dec14-2889130.pdf?src-supplier=Digi-Key; ComponentLink5Description: https://datasheet.ciiva.com/2889/js-9dec14-2889130.pdf?src-supplier=Digi-Key; ComponentLink6URL: https://datasheet.ciiva.com/8625/js-9dec14-8625466.pdf?src-supplier=Avnet; ComponentLink6Description: https://datasheet.ciiva.com/8625/js-9dec14-8625466.pdf?src-supplier=Avnet; ComponentLink7URL: https://datasheet.ciiva.com/2889/js-9dec14-2889131.pdf?src-supplier=Digi-Key; ComponentLink7Description: https://datasheet.ciiva.com/2889/js-9dec14-2889131.pdf?src-supplier=Digi-Key; ComponentLink8URL: https://datasheet.ciiva.com/2889/js-9dec14-2889132.pdf?src-supplier=Digi-Key; ComponentLink8Description: https://datasheet.ciiva.com/2889/js-9dec14-2889132.pdf?src-supplier=Digi-Key; ComponentLink9URL: https://datasheet.ciiva.com/16174/js-3nov11-16174349.pdf?src-supplier=Onlinecomponents.com; ComponentLink9Description: https://datasheet.ciiva.com/16174/js-3nov11-16174349.pdf?src-supplier=Onlinecomponents.com; Supplier Part Number 1: 401-1999-1-ND
SL1 SL2 = 61300111121: CONN HEADER VERT 1POS; Manufacturer: Wurth Electronics; Number of Positions: 1; Gender: Male; Connector Type: Male Pin; Supplier 1: Digi-Key; Manufacturer Part Number: 61300111121; RoHS: Yes; Category: Connectors; Stock 1: 11266; Pricing 1: 1=0.13000, 10=0.10600, 25=0.08800, 50=0.07400, 100=0.06700, 1000=0.06100 (USD); Mount: Through Hole; Contact Plating: Gold; Contact Material: Copper; Color: Black; Packaging: Bulk; Number of Rows: 1; Termination: Solder; Number of Contacts: 1; Contact Mating Length: 0.236inch; REACH SVHC: Unknown; ComponentLink1URL: http://www.farnell.com/cad/1737268.pdf?src-supplier=Element14; ComponentLink1Description: http://www.farnell.com/cad/1737268.pdf?src-supplier=Element14; ComponentLink2URL: https://katalog.we-online.de/em/datasheet/6130xx11121.pdf?src-supplier=Digi-Key; ComponentLink2Description: https://katalog.we-online.de/em/datasheet/6130xx11121.pdf?src-supplier=Digi-Key; Supplier Part Number 1: 732-5314-ND
T1 = TP4056: TP4056 1A Standalone Linear Li-lon Battery Charger with Thermal / Regulation in SOP-8
V1 V3 = C1030B028F: Vibration Erm Motor 9000 Rpm 3V; Manufacturer: Jinlong Machinery & Electronics; Supplier 1: Digi-Key; Manufacturer Part Number: C1030B028F; RoHS: No; Category: Motors and Drives; Stock 1: 2484; Pricing 1: 1=2.88000, 5=2.73200, 10=2.65700, 25=2.58080, 50=2.35300, 100=2.12520, 250=2.04932, 500=2.01894, 1000=1.89750 (USD); Min Operating Temperature: -20°C; Max Operating Temperature: 60°C; RPM: 9000RPM; Termination: Wire Leads; ComponentLink1URL: http://www.vibration-motor.com/products/download/C1030B028F.pdf?src-supplier=Digi-Key; ComponentLink1Description: http://www.vibration-motor.com/products/download/C1030B028F.pdf?src-supplier=Digi-Key; Supplier Part Number 1: 1670-1052-ND
V2 = AZ1117EH-3.3TRG1: IC REG LINEAR 3.3V 1A SOT223; Manufacturer: Diodes; Polarity: Positive; Quiescent Current: 3.5mA; Accuracy: 1%; Reference Voltage: 1.262V; Dropout Voltage: 1.1V; Number of Regulators: 1; Max Input Voltage: 13V; Power Supply Rejection Ratio (PSRR): 70dB; Output Type: Fixed; Supplier 1: Digi-Key; Manufacturer Part Number: AZ1117EH-3.3TRG1; RoHS: Yes; Category: Voltage Regulators - Linear; Stock 1: 165000; Pricing 1: 4000=0.07858, 8000=0.07072, 12000=0.06286, 28000=0.05894, 100000=0.05108, 200000=0.05029 (USD); Mount: Surface Mount; Case/Package: TO-261-4; Number of Pins: 3; Contact Plating: Tin; Weight: 0.000282oz; Min Operating Temperature: -40°C; Max Operating Temperature: 125°C; Max Output Current: 1A; Packaging: Tape and Reel; Output Voltage: 3.3V; Output Current: 1A; Number of Outputs: 1; Operating Supply Current: 3.5mA; Package Quantity: 4000; Lead Free: Lead Free; ComponentLink1URL: http://www.mouser.com/ds/2/115/Diodes_AZ1117E-516247.pdf?src-supplier=Mouser; ComponentLink1Description: http://www.mouser.com/ds/2/115/Diodes_AZ1117E-516247.pdf?src-supplier=Mouser; ComponentLink2URL: http://diodes.com/datasheets/AZ1117E.pdf?src-supplier=Avnet; ComponentLink2Description: http://diodes.com/datasheets/AZ1117E.pdf?src-supplier=Avnet; ComponentLink3URL: https://www.diodes.com/assets/Datasheets/AZ1117E.pdf?src-supplier=Digi-Key; ComponentLink3Description: https://www.diodes.com/assets/Datasheets/AZ1117E.pdf?src-supplier=Digi-Key; Supplier Part Number 1: AZ1117EH-3.3TRG1DITR-ND